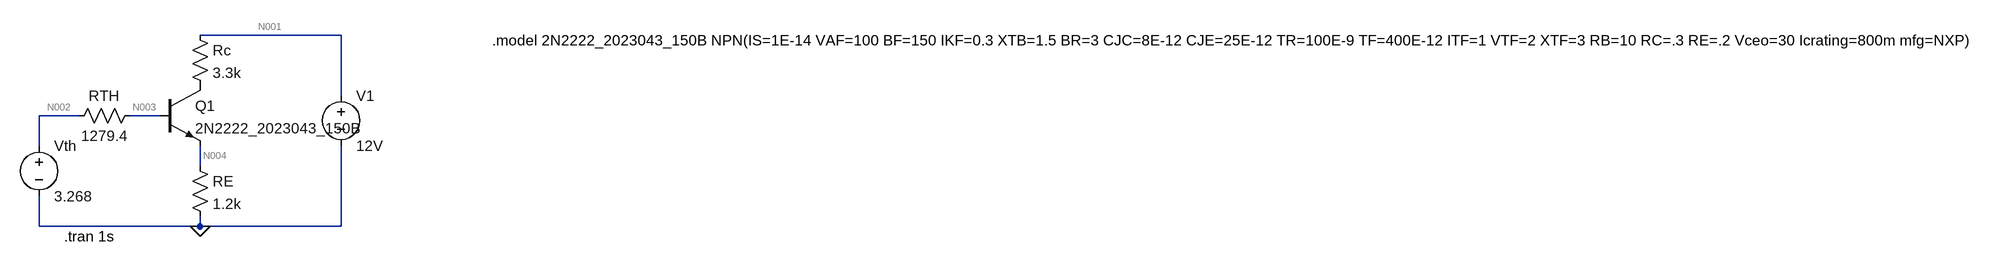
[diagram p0: schematic Draft1.asc]
Draft1.asc, the LTspice schematic file:
Version 4.1
SHEET 1 3292 680
WIRE 512 128 288 128
WIRE 512 224 512 128
WIRE 96 256 32 256
WIRE 224 256 176 256
WIRE 32 304 32 256
WIRE 288 336 288 304
WIRE 32 432 32 384
WIRE 288 432 288 416
WIRE 288 432 32 432
WIRE 512 432 512 304
WIRE 512 432 288 432
FLAG 288 432 0
SYMBOL res 272 112 R0
SYMATTR InstName Rc
SYMATTR Value 3.3k
SYMBOL npn 224 208 R0
SYMATTR InstName Q1
SYMATTR Value 2N2222_2023043_150B
SYMBOL voltage 512 208 R0
WINDOW 123 0 0 Left 0
WINDOW 39 0 0 Left 0
SYMATTR InstName V1
SYMATTR Value 12V
SYMBOL res 272 320 R0
SYMATTR InstName RE
SYMATTR Value 1.2k
SYMBOL res 192 240 R90
WINDOW 0 0 56 VBottom 2
WINDOW 3 32 56 VTop 2
SYMATTR InstName RTH
SYMATTR Value 1279.4
SYMBOL voltage 32 288 R0
WINDOW 123 0 0 Left 0
WINDOW 39 0 0 Left 0
SYMATTR InstName Vth
SYMATTR Value 3.268
TEXT 72 448 Left 2 !.tran 1s
TEXT 752 136 Left 2 !.model 2N2222_2023043_150B NPN(IS=1E-14 VAF=100 BF=150 IKF=0.3 XTB=1.5 BR=3 CJC=8E-12 CJE=25E-12 TR=100E-9 TF=400E-12 ITF=1 VTF=2 XTF=3 RB=10 RC=.3 RE=.2 Vceo=30 Icrating=800m mfg=NXP)

The netlist it stands for:
* Draft1.asc
Rc N001 P001 3.3k
Q1 P001 N003 N004 0 2N2222_2023043_150B
V1 N001 0 12V
RE N004 0 1.2k
RTH N003 N002 1279.4
Vth N002 0 3.268
.model NPN NPN
.model PNP PNP
.lib standard.bjt
.tran 1s
.model 2N2222_2023043_150B NPN(IS=1E-14 VAF=100 BF=150 IKF=0.3 XTB=1.5 BR=3 CJC=8E-12 CJE=25E-12 TR=100E-9 TF=400E-12 ITF=1 VTF=2 XTF=3 RB=10 RC=.3 RE=.2 Vceo=30 Icrating=800m mfg=NXP)
.backanno
.end

* Results of the author's LTspice run, read from the files saved beside the schematic
* Operating Point, zero values left out:
*   V(p001) = 4.965 V
*   V(n004) = 2.575 V
*   V(n002) = 3.268 V
*   V(n001) = 12 V
*   V(n003) = 3.25 V
*   I(V1) = -2.132 mA
*   I(RTH) = -14.07 µA
*   I(Rc) = 2.132 mA
*   I(Vth) = -14.07 µA
*   Ic(Q1) = 2.132 mA
*   Ib(Q1) = 14.07 µA
*   Ie(Q1) = -2.146 mA
*   I(RE) = 2.146 mA